# Altium schematic sheet 0_wiring drawing.SchDoc: History
size A4; CheckedBy: Among; DrawnBy: Jack; Address1: 1; Address2: 2; Address3: 3; Address4: 4; DocumentNumber: 04-TE-42-4015-0PA-A; Revision: B; SheetNumber: 1; SheetTotal: 5; SheetSize: A4; CheckedByDate: 2022-01-11; DrawByDate: 2022-01-11; SiteName: Huangpu Test Development; ProjectName: 19205_BMW CCU DDR PCBA FT fixture wiring
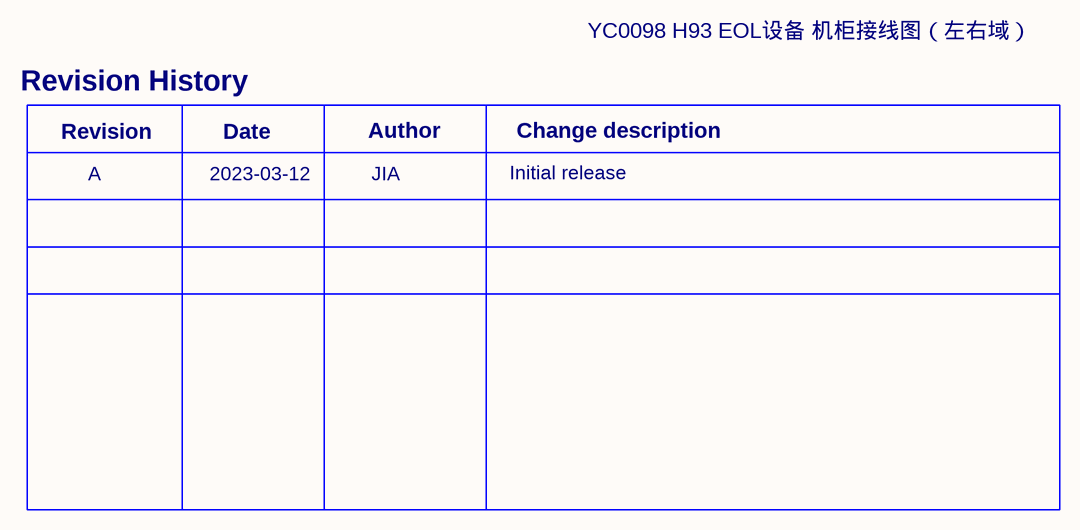
[diagram p0: 0_wiring drawing.SchDoc]

## Notes on the sheet
- YC0098 H93 EOL设备 机柜接线图（左右域）
- Revision History
- Revision
- Date
- Author
- Initial release
- Change description
- A
- 2023-03-12
- JIA
- Document Number:
- Project Name:
- Rev:
- Drawn By:
- Date:
- Titile:
- Checked By:
- Sheet:
- Of